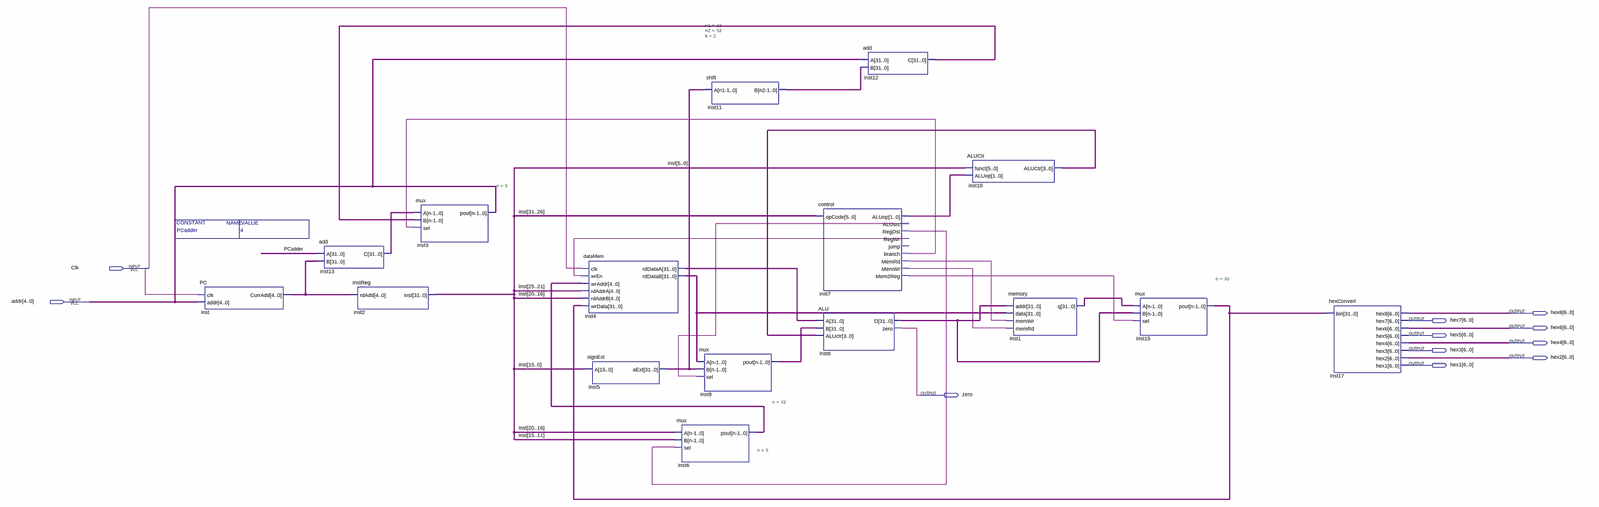
[diagram p0: schematic sheet, whole]
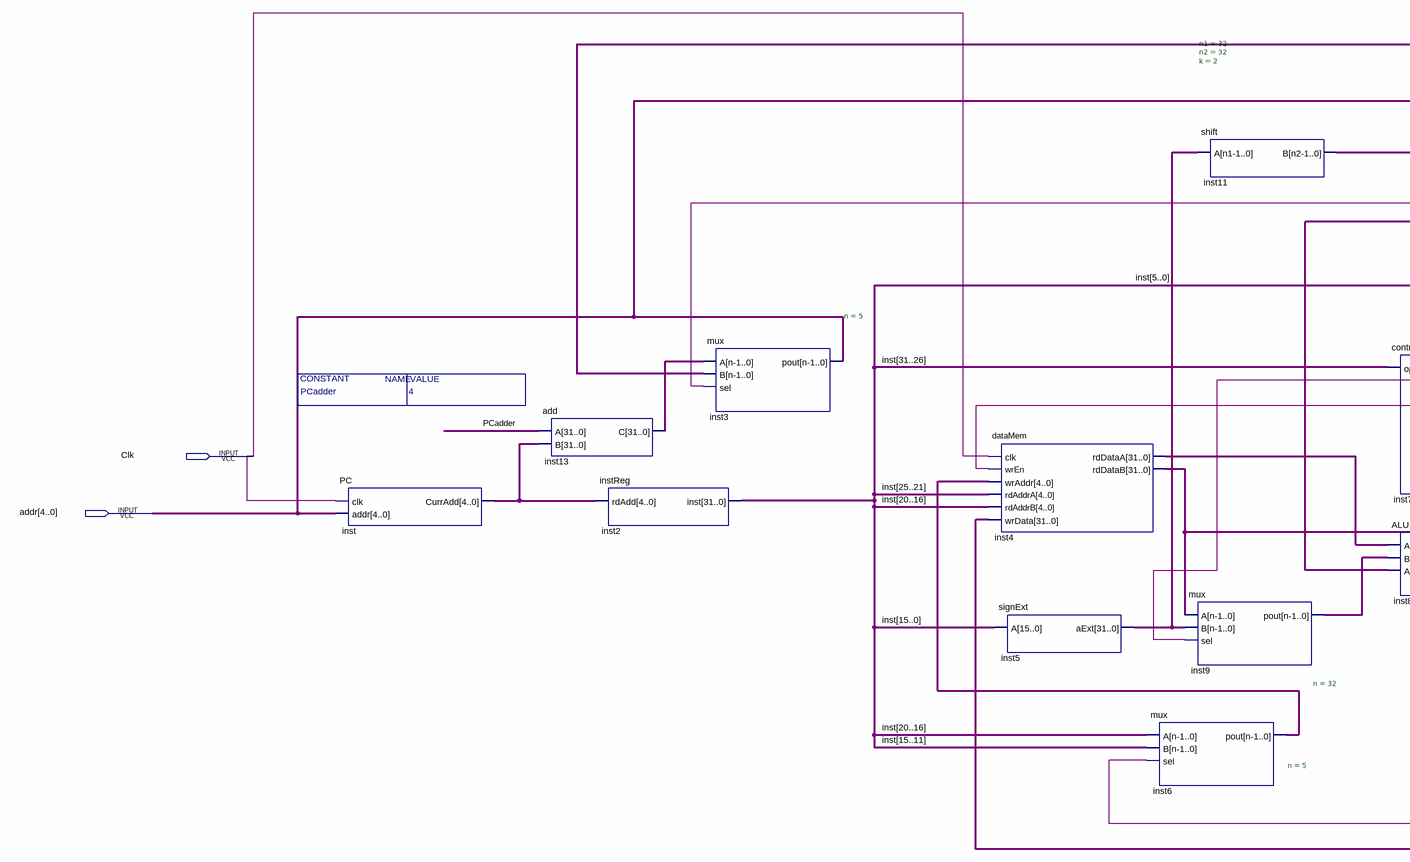
[diagram p1: schematic sheet, left part]
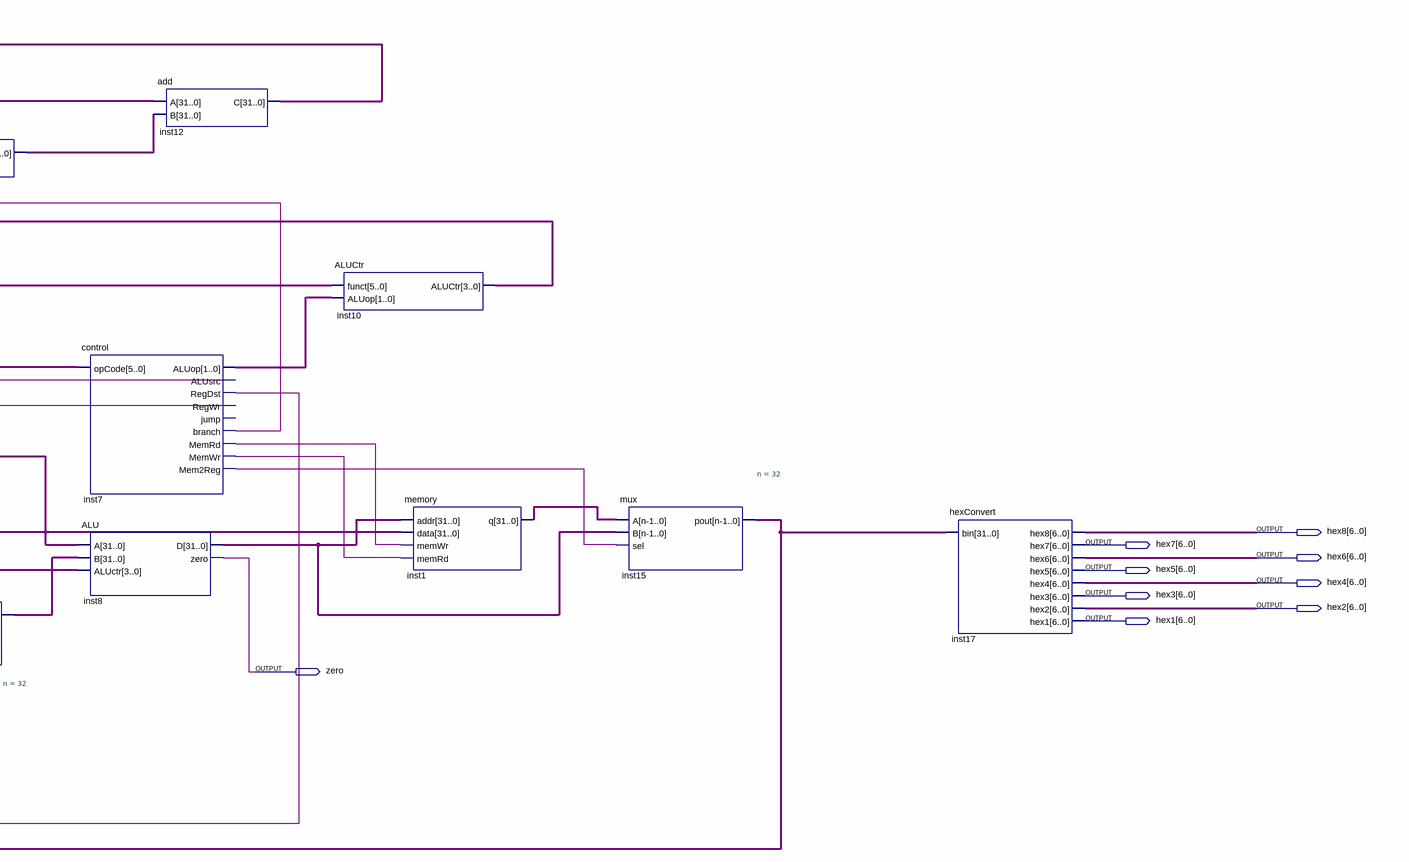
[diagram p2: schematic sheet, right part]
// Quartus schematic HAMMAMCPU.bdf as structural Verilog: 16 symbols, 11 pins
module HAMMAMCPU #(parameter PCadder = 4) (
  input  Clk,
  input  [4:0] addr,
  output [6:0] hex8,
  output [6:0] hex7,
  output [6:0] hex6,
  output [6:0] hex5,
  output [6:0] hex4,
  output [6:0] hex3,
  output [6:0] hex2,
  output [6:0] hex1,
  output zero
);

  wire inst7_alusrc, inst7_branch, inst7_mem2reg, inst7_memrd, inst7_memwr, inst7_regdst, inst7_regwr,
       PCadder;
  wire [1:0] inst7_aluop;
  wire [3:0] inst10_aluctr;
  wire [4:0] inst6_pout;
  wire [31:0] inst, inst1_q, inst4_rddataa, inst4_rddatab, inst5_aext, inst8_d, inst9_pout, inst11_b,
       inst12_c, inst13_c, inst15_pout, inst_curradd;

  PC u_inst (.clk(Clk), .addr(addr), .CurrAdd(inst_curradd));
  add inst13 (.A({32{PCadder}}), .B(inst_curradd), .C(inst13_c));
  instReg inst2 (.rdAdd(inst_curradd), .inst(inst));
  mux #(.n(5)) inst3 (.A(inst13_c), .B(inst12_c), .sel(inst7_branch), .pout(addr));
  dataMem inst4 (
    .clk(Clk), .wrEn(inst7_regwr), .wrAddr(inst6_pout), .rdAddrA(inst[25:21]), .rdAddrB(inst[20:16]),
    .wrData(inst15_pout), .rdDataA(inst4_rddataa), .rdDataB(inst4_rddatab));
  signExt inst5 (.A(inst[15:0]), .aExt(inst5_aext));
  mux #(.n(32)) inst9 (.A(inst4_rddatab), .B(inst5_aext), .sel(inst7_alusrc), .pout(inst9_pout));
  mux #(.n(5)) inst6 (.A(inst[20:16]), .B(inst[15:11]), .sel(inst7_regdst), .pout(inst6_pout));
  shift #(.n1(32), .n2(32), .k(2)) inst11 (.A(inst5_aext), .B(inst11_b));
  control inst7 (
    .opCode(inst[31:26]), .ALUop(inst7_aluop), .ALUsrc(inst7_alusrc), .RegDst(inst7_regdst),
    .RegWr(inst7_regwr), .branch(inst7_branch), .MemRd(inst7_memrd), .MemWr(inst7_memwr),
    .Mem2Reg(inst7_mem2reg));  // open: jump
  ALU inst8 (.A(inst4_rddataa), .B(inst9_pout), .ALUctr(inst10_aluctr), .D(inst8_d), .zero(zero));
  add inst12 (.A(addr), .B(inst11_b), .C(inst12_c));
  ALUCtr inst10 (.funct(inst[5:0]), .ALUop(inst7_aluop), .ALUCtr(inst10_aluctr));
  memory inst1 (.addr(inst8_d), .data(inst4_rddatab), .memWr(inst7_memrd), .memRd(inst7_memwr), .q(inst1_q));
  mux #(.n(32)) inst15 (.A(inst1_q), .B(inst8_d), .sel(inst7_mem2reg), .pout(inst15_pout));
  hexConvert inst17 (
    .bin(inst15_pout), .hex8(hex8), .hex7(hex7), .hex6(hex6), .hex5(hex5), .hex4(hex4), .hex3(hex3),
    .hex2(hex2), .hex1(hex1));
endmodule
